# EasyEDA schematic Editable Schematic File.json
TITLE: Desk LCD Driver; REV: 1.0; Date: 2024-10-29; Sheet: 1/1; Drawn By: williammarktaylor; Company: T93
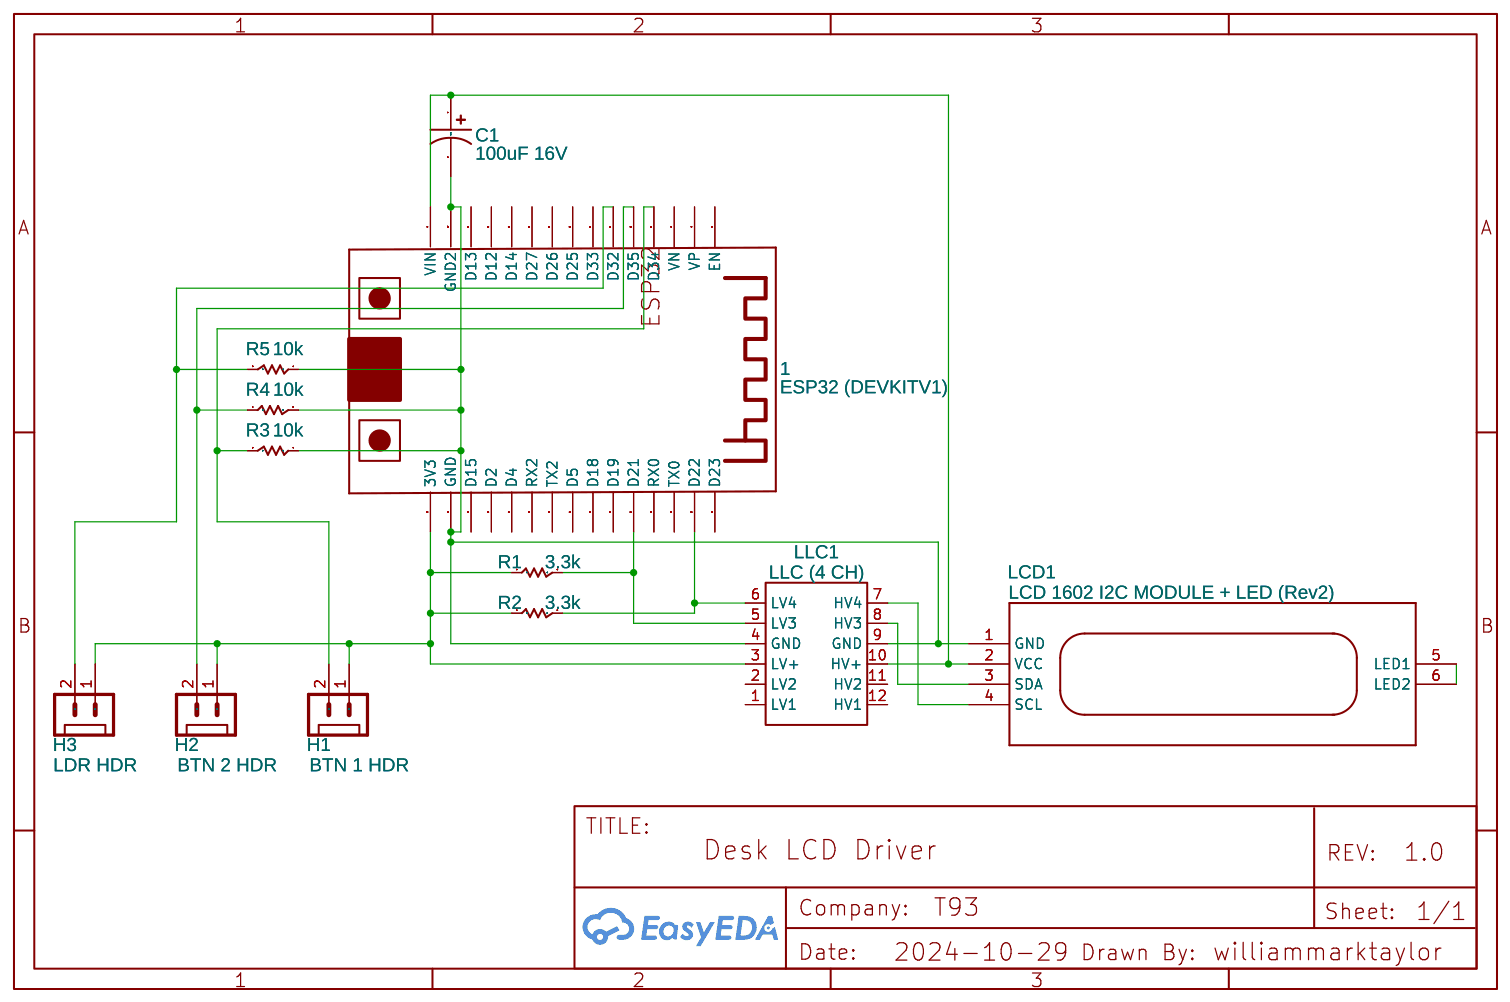
[diagram p0: schematic sheet]

## Parts
1  ESP32 (DEVKITV1)  [ESP32 (DEVKITV1)]
C1  100uF 16V  [CAP-D5.0×F2.0]
H1  BTN 1 HDR  [JST-2.54-2PIN-CONNECTOR]
H2  BTN 2 HDR  [JST-2.54-2PIN-CONNECTOR]
H3  LDR HDR  [JST-2.54-2PIN-CONNECTOR]
LCD1  LCD 1602 I2C MODULE + LED (Rev2)  [LCD 1602 I2C MODULE + LED (REV2)]
LLC1  LLC (4 CH)  [LOGIC-LEVEL-CONVERTER-4CH]
R1  3.3k  [R_AXIAL-0.3]
R2  3.3k  [R_AXIAL-0.3]
R3  10k  [R_AXIAL-0.3]
R4  10k  [R_AXIAL-0.3]
R5  10k  [R_AXIAL-0.3]

## Library data of the parts
1 = ESP32-DEVKIT-V1-30PIN: Contributor: williammarktaylor
C1 = CE_TH_D5.0×F2.0_US: Contributor: LCEDA_Lib
H1-H3 = 2PIN-HEADER-2.54: Contributor: Павел Колесов
LCD1 = LCD 1602 I2C MODULE + LED (Rev2): Contributor: williammarktaylor
LLC1 = Logic-Level Converter (4CH): Supplier Part: 50807; Contributor: danishjr.hd
R1-R5 = R_AXIAL-0.3_US-minified-sch: Contributor: williammarktaylor

## Nets
Net-(1-3V3): 1.3V3 H1.1 H2.1 H3.1 LLC1.3(LV+) R1.1 R2.1
Net-(1-D21): 1.D21 LLC1.5(LV3) R1.2
Net-(1-D22): 1.D22 LLC1.6(LV4) R2.2
Net-(1-D32): 1.D32 H3.2 R5.2
Net-(1-D34): 1.D34 H1.2 R3.2
Net-(1-D35): 1.D35 H2.2 R4.1
Net-(1-GND): 1.GND 1.GND2 C1.2 LCD1.1(GND) LLC1.4(GND) LLC1.9(GND) R3.1 R4.2 R5.1
Net-(1-VIN): 1.VIN C1.1 LCD1.2(VCC) LLC1.10(HV+)
Net-(LCD1-3): LCD1.3(SDA) LLC1.8(HV3)
Net-(LCD1-4): LCD1.4(SCL) LLC1.7(HV4)
Net-(LCD1-5): LCD1.5(LED1) LCD1.6(LED2)

Not connected (* = marked no-connect by the designer): 1 D2 D4 D5 D12 D13 D14 D15 D18 D19 D23 D25 D26 D27 D33 EN RX0 RX2 TX0 TX2 VN VP; LLC1 1(LV1) 2(LV2) 11(HV2) 12(HV1)
